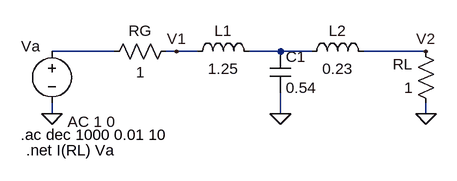
[diagram p0: schematic norm-param-s.asc]
norm-param-s.asc, the LTspice schematic file:
Version 4
SHEET 1 880 680
WIRE -16 112 -112 112
WIRE 80 112 64 112
WIRE 112 112 80 112
WIRE 240 112 192 112
WIRE 288 112 240 112
WIRE 464 112 368 112
WIRE -112 208 -112 192
WIRE 240 208 240 176
WIRE 464 208 464 192
FLAG 464 208 0
FLAG 240 208 0
FLAG -112 208 0
FLAG 80 112 V1
FLAG 464 112 V2
SYMBOL res 80 96 R90
WINDOW 0 0 56 VBottom 2
WINDOW 3 32 56 VTop 2
SYMATTR InstName RG
SYMATTR Value 1
SYMBOL res 480 208 R180
WINDOW 0 36 76 Left 2
WINDOW 3 36 40 Left 2
SYMATTR InstName RL
SYMATTR Value 1
SYMBOL ind 96 128 R270
WINDOW 0 32 56 VTop 2
WINDOW 3 5 56 VBottom 2
SYMATTR InstName L1
SYMATTR Value 1.25
SYMBOL ind 272 128 R270
WINDOW 0 32 56 VTop 2
WINDOW 3 5 56 VBottom 2
SYMATTR InstName L2
SYMATTR Value 0.23
SYMBOL cap 224 112 R0
SYMATTR InstName C1
SYMATTR Value 0.54
SYMBOL voltage -112 96 R0
WINDOW 0 -47 8 Left 2
WINDOW 123 24 124 Left 2
WINDOW 39 0 0 Left 0
SYMATTR InstName Va
SYMATTR Value ""
SYMATTR Value2 AC 1 0
TEXT -160 240 Left 2 !.ac dec 1000 0.01 10
TEXT -152 264 Left 2 !.net I(RL) Va

The netlist it stands for:
* norm-param-s.asc
RG V1 N001 1
RL 0 V2 1
L1 V1 N002 1.25
L2 N002 V2 0.23
C1 N002 0 0.54
Va N001 0 AC 1 0
.ac dec 1000 0.01 10
.net I(RL) Va
.backanno
.end

* Results of the author's LTspice run, read from the files saved beside the schematic
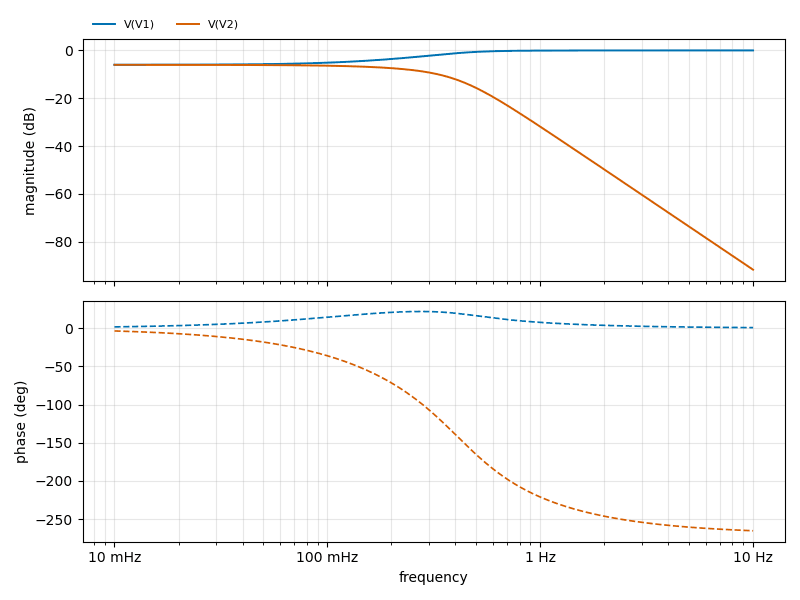
[diagram p1: AC Analysis of norm-param-s.asc, plotted from the saved traces]
* AC Analysis, 1 run:
*   V(V1): -6.00 dB at 10 mHz, -0.00 dB at 10 Hz, peak -0.00 dB at 10 Hz, 3 dB below the peak at 240.3 mHz
*   V(V2): -6.03 dB at 10 mHz, -91.71 dB at 10 Hz, peak -6.03 dB at 10 mHz, 3 dB below the peak at 291.7 mHz